# Altium schematic sheet Motor Control.SchDoc
size B; SheetNumber: 2; SheetTotal: 5
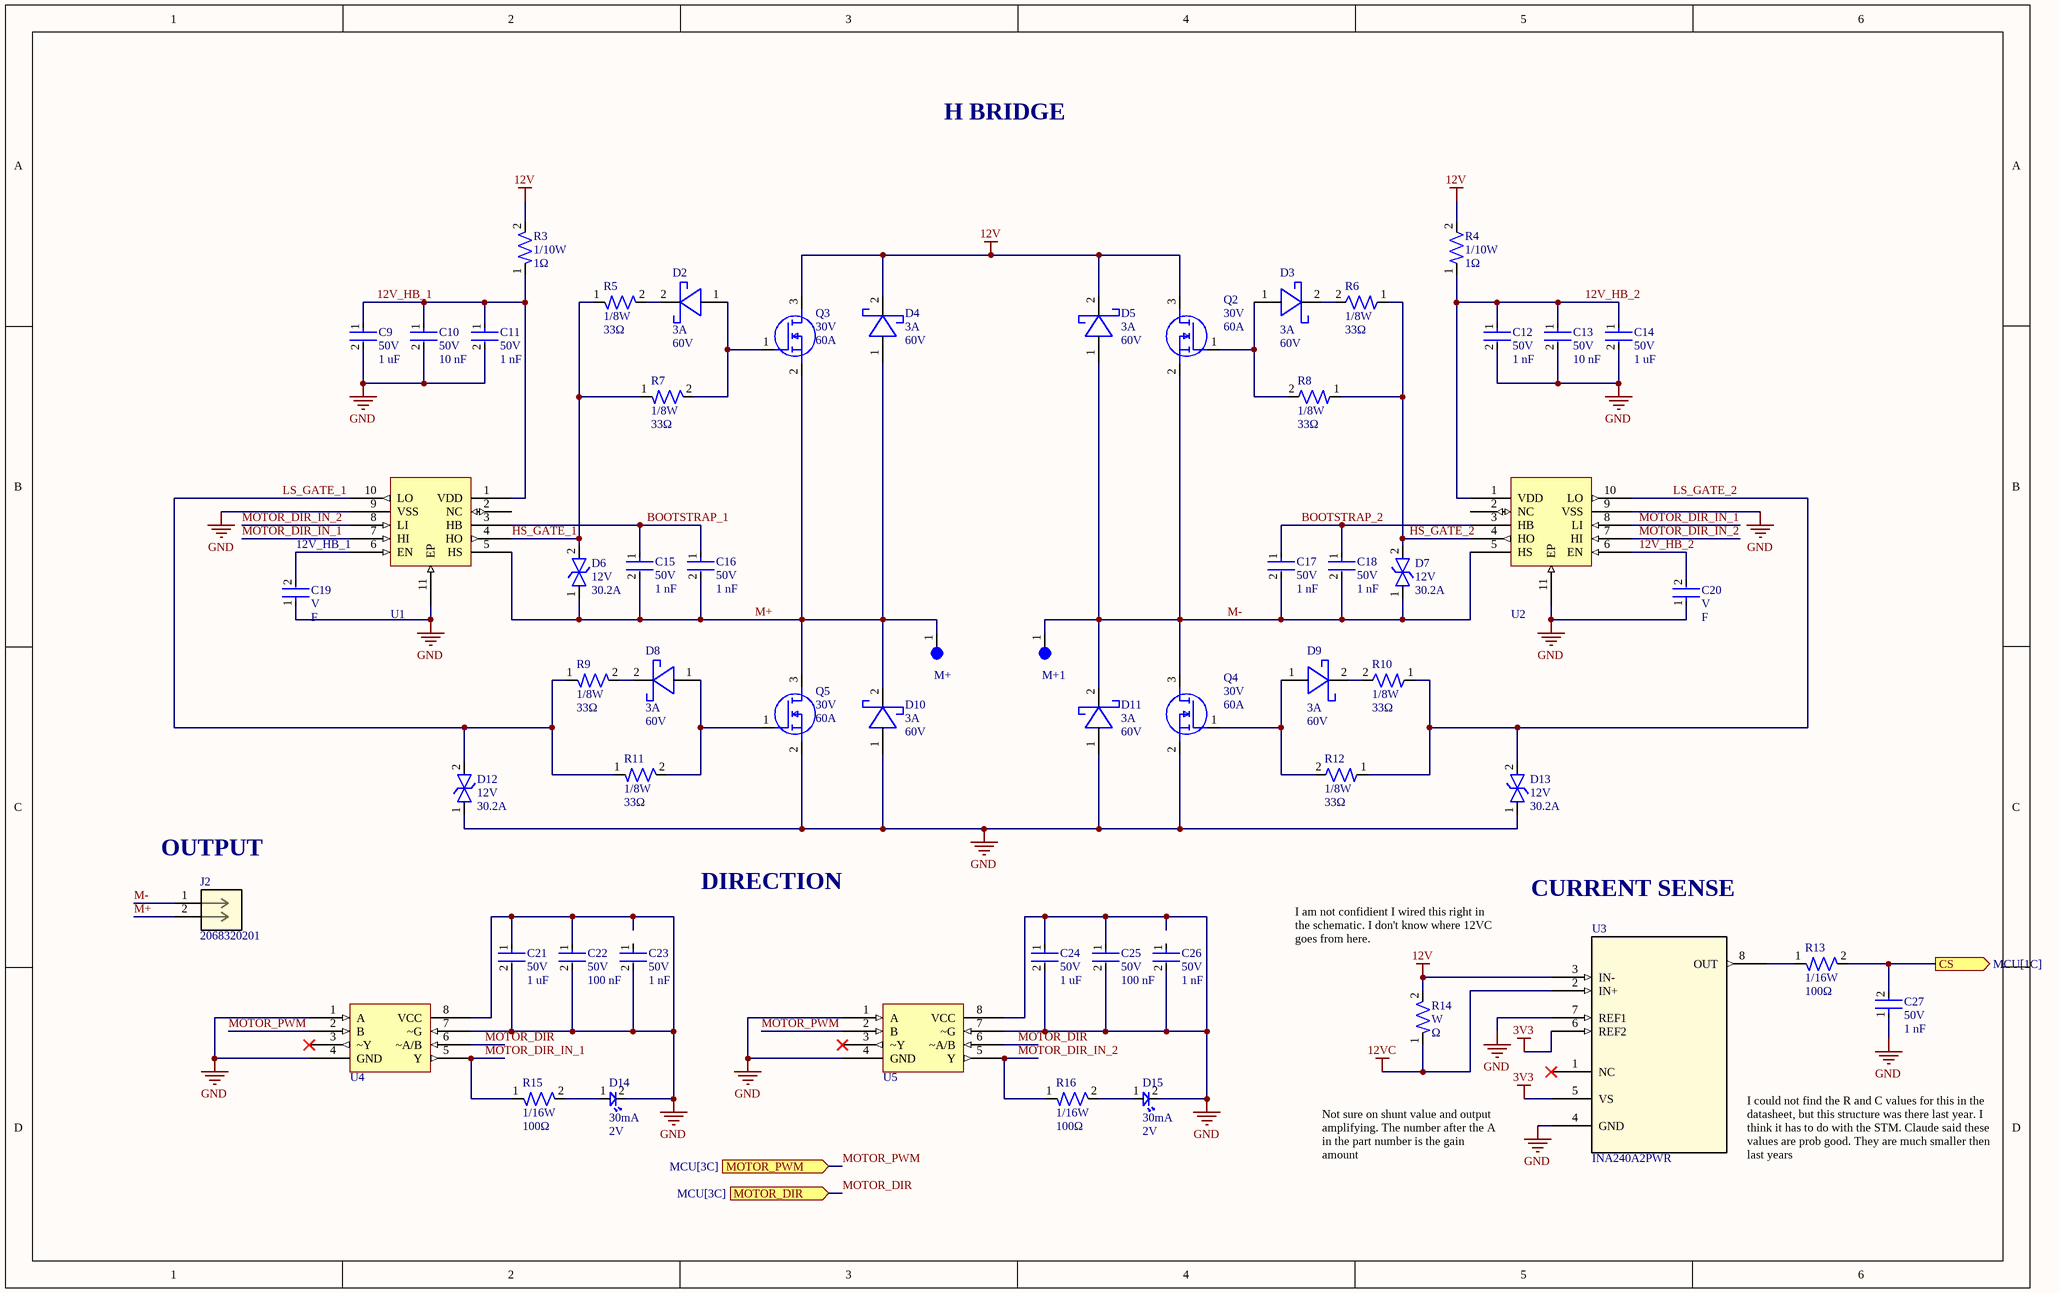
[diagram p0: Motor Control.SchDoc]

## Parts
C9  Voltage Rating: 50V  Capacitance: 1 uF  [CAP-0805]  (hidden comment: CAP 0805)
C10  Voltage Rating: 50V  Capacitance: 10 nF  [CAP-0805]  (hidden comment: CAP 0805)
C11  Voltage Rating: 50V  Capacitance: 1 nF  [CAP-0805]  (hidden comment: CAP 0805)
C12  Voltage Rating: 50V  Capacitance: 1 nF  [CAP-0805]  (hidden comment: CAP 0805)
C13  Voltage Rating: 50V  Capacitance: 10 nF  [CAP-0805]  (hidden comment: CAP 0805)
C14  Voltage Rating: 50V  Capacitance: 1 uF  [CAP-0805]  (hidden comment: CAP 0805)
C15  Voltage Rating: 50V  Capacitance: 1 nF  [CAP-0805]  (hidden comment: CAP 0805)
C16  Voltage Rating: 50V  Capacitance: 1 nF  [CAP-0805]  (hidden comment: CAP 0805)
C17  Voltage Rating: 50V  Capacitance: 1 nF  [CAP-0805]  (hidden comment: CAP 0805)
C18  Voltage Rating: 50V  Capacitance: 1 nF  [CAP-0805]  (hidden comment: CAP 0805)
C19  Voltage Rating: V  Capacitance: F  [CAP-0603]  (hidden comment: CAP 0603)
C20  Voltage Rating: V  Capacitance: F  [CAP-0603]  (hidden comment: CAP 0603)
C21  Voltage Rating: 50V  Capacitance: 1 uF  [CAP-0805]  (hidden comment: CAP 0805)
C22  Voltage Rating: 50V  Capacitance: 100 nF  [CAP-0805]  (hidden comment: CAP 0805)
C23  Voltage Rating: 50V  Capacitance: 1 nF  [CAP-0805]  (hidden comment: CAP 0805)
C24  Voltage Rating: 50V  Capacitance: 1 uF  [CAP-0805]  (hidden comment: CAP 0805)
C25  Voltage Rating: 50V  Capacitance: 100 nF  [CAP-0805]  (hidden comment: CAP 0805)
C26  Voltage Rating: 50V  Capacitance: 1 nF  [CAP-0805]  (hidden comment: CAP 0805)
C27  Voltage Rating: 50V  Capacitance: 1 nF  [CAP-0805]  (hidden comment: CAP 0805)
D2  Current Rating: 3A  Reverse Voltage: 60V  [DIO-SOD128]  (hidden comment: PMEG6030EP,115)
D3  Current Rating: 3A  Reverse Voltage: 60V  [DIO-SOD128]  (hidden comment: PMEG6030EP,115)
D4  Current Rating: 3A  Reverse Voltage: 60V  [DIO-SOD128]  (hidden comment: PMEG6030EP,115)
D5  Current Rating: 3A  Reverse Voltage: 60V  [DIO-SOD128]  (hidden comment: PMEG6030EP,115)
D6  Voltage Rating: 12V  Current Rating: 30.2A  [DO-214AA (SMBJ)]  (hidden comment: SMBJ40CA)
D7  Voltage Rating: 12V  Current Rating: 30.2A  [DO-214AA (SMBJ)]  (hidden comment: SMBJ40CA)
D8  Current Rating: 3A  Reverse Voltage: 60V  [DIO-SOD128]  (hidden comment: PMEG6030EP,115)
D9  Current Rating: 3A  Reverse Voltage: 60V  [DIO-SOD128]  (hidden comment: PMEG6030EP,115)
D10  Current Rating: 3A  Reverse Voltage: 60V  [DIO-SOD128]  (hidden comment: PMEG6030EP,115)
D11  Current Rating: 3A  Reverse Voltage: 60V  [DIO-SOD128]  (hidden comment: PMEG6030EP,115)
D12  Voltage Rating: 12V  Current Rating: 30.2A  [DO-214AA (SMBJ)]  (hidden comment: SMBJ40CA)
D13  Voltage Rating: 12V  Current Rating: 30.2A  [DO-214AA (SMBJ)]  (hidden comment: SMBJ40CA)
D14  Forward Current: 30mA  Forward Voltage: 2V  [LED-0603]  (hidden comment: BL-HKC36G-AV-TRB)
D15  Forward Current: 30mA  Forward Voltage: 2V  [LED-0603]  (hidden comment: BL-HKC36G-AV-TRB)
J2  2068320201  [CONN_2068320000-SD_02_MOL]
M+  5003  [TEST-POINT-0001]  (value not drawn)
M+1  5003  [TEST-POINT-0001]  (value not drawn)
Q2  Voltage: 30V  Continuous Current: 60A  [IC-8VSONCLIP]  (hidden comment: CSD17575Q3)
Q3  Voltage: 30V  Continuous Current: 60A  [IC-8VSONCLIP]  (hidden comment: CSD17575Q3)
Q4  Voltage: 30V  Continuous Current: 60A  [IC-8VSONCLIP]  (hidden comment: CSD17575Q3)
Q5  Voltage: 30V  Continuous Current: 60A  [IC-8VSONCLIP]  (hidden comment: CSD17575Q3)
R3  Wattage: 1/10W  Resistance: 1Ω  [RES-0805]  (hidden comment: RES 0805)
R4  Wattage: 1/10W  Resistance: 1Ω  [RES-0805]  (hidden comment: RES 0805)
R5  Wattage: 1/8W  Resistance: 33Ω  [RES-0805]  (hidden comment: RES 0805)
R6  Wattage: 1/8W  Resistance: 33Ω  [RES-0805]  (hidden comment: RES 0805)
R7  Wattage: 1/8W  Resistance: 33Ω  [RES-0805]  (hidden comment: RES 0805)
R8  Wattage: 1/8W  Resistance: 33Ω  [RES-0805]  (hidden comment: RES 0805)
R9  Wattage: 1/8W  Resistance: 33Ω  [RES-0805]  (hidden comment: RES 0805)
R10  Wattage: 1/8W  Resistance: 33Ω  [RES-0805]  (hidden comment: RES 0805)
R11  Wattage: 1/8W  Resistance: 33Ω  [RES-0805]  (hidden comment: RES 0805)
R12  Wattage: 1/8W  Resistance: 33Ω  [RES-0805]  (hidden comment: RES 0805)
R13  Wattage: 1/16W  Resistance: 100Ω  [RES-0805]  (hidden comment: RES 0805)
R14  Wattage: W  Resistance: Ω  [RES-2512]  (hidden comment: RES 2512)
R15  Wattage: 1/16W  Resistance: 100Ω  [RES-0805]  (hidden comment: RES 0805)
R16  Wattage: 1/16W  Resistance: 100Ω  [RES-0805]  (hidden comment: RES 0805)
U1  UCC27282DRCR  [IC-10VSON]  (value not drawn)
U2  UCC27282DRCR  [IC-10VSON]  (value not drawn)
U3  INA240A2PWR  [PW0008A_N_TEX]
U4  SN74LVC2G157DCUR  [IC-8VSSOP]  (value not drawn)
U5  SN74LVC2G157DCUR  [IC-8VSSOP]  (value not drawn)

## Ports
CS (out, see MCU[1C]), MOTOR_DIR (in, see MCU[3C]), MOTOR_PWM (in, see MCU[3C])

## Nets
3V3: U3.5(VS) U3.6(REF2)
12V: D4.2(ANODE) D5.2(ANODE) Q2.3(D) Q3.3(D) R3.2 R4.2 R14.2 U3.3(IN-)
12VC: R14.1 U3.2(IN+)
GND: C9.2 C10.2 C11.2 C12.2 C13.2 C14.2 C19.1 C20.1 C21.1 C21.2 C22.1 C22.2 C23.2 C24.1 C24.2 C25.1 C25.2 C26.2 C27.1 D10.1(CATHODE) D11.1(CATHODE) D12.1 D13.1 D14.2 D15.2 Q4.2(S) Q5.2(S) U1.9(VSS) U1.11(EP) U2.9(VSS) U2.11(EP) U3.4(GND) U3.7(REF1) U4.1(A) U4.4(GND) U4.7(~G) U4.8(VCC) U5.1(A) U5.4(GND) U5.7(~G) U5.8(VCC)
12V_HB_1: C9.1 C10.1 C11.1 R3.1 U1.1(VDD)
12V_HB_2: C12.1 C13.1 C14.1 C20.2 R4.1 U2.1(VDD) U2.6(EN)
BOOTSTRAP_1: C15.1 C16.1 U1.3(HB)
BOOTSTRAP_2: C17.1 C18.1 U2.3(HB)
CS: C27.2 R13.2 ; port CS
HS_GATE_1: D6.2 R5.1 R7.1 U1.4(HO)
HS_GATE_2: D7.2 R6.1 R8.1 U2.4(HO)
LS_GATE_1: D12.2 R9.1 R11.1 U1.10(LO)
LS_GATE_2: D13.2 R10.1 R12.1 U2.10(LO)
M+: C15.2 C16.2 D4.1(CATHODE) D6.1 D10.2(ANODE) J2.2 M+.1 Q3.2(S) Q5.3(D) U1.5(HS)
M-: C17.2 C18.2 D5.1(CATHODE) D7.1 D11.2(ANODE) J2.1 M+1.1 Q2.2(S) Q4.3(D) U2.5(HS)
MOTOR_DIR: U4.6(~A/B) U5.6(~A/B) ; port MOTOR_DIR
MOTOR_DIR_IN_1: R15.1 U1.7(HI) U2.8(LI) U4.5(Y)
MOTOR_DIR_IN_2: R16.1 U1.8(LI) U2.7(HI) U5.5(Y)
MOTOR_PWM: U4.2(B) U5.2(B) ; port MOTOR_PWM
NetC19_2: C19.2 U1.6(EN)
NetD2_1: D2.1(CATHODE) Q3.1(G) R7.2
NetD2_2: D2.2(ANODE) R5.2
NetD3_1: D3.1(CATHODE) Q2.1(G) R8.2
NetD3_2: D3.2(ANODE) R6.2
NetD8_1: D8.1(CATHODE) Q5.1(G) R11.2
NetD8_2: D8.2(ANODE) R9.2
NetD9_1: D9.1(CATHODE) Q4.1(G) R12.2
NetD9_2: D9.2(ANODE) R10.2
NetD14_1: D14.1 R15.2
NetD15_1: D15.1 R16.2
NetR13_1: R13.1 U3.8(OUT)

Not connected (* = marked no-connect by the designer): C23 1; C26 1; U1 2(NC); U2 2(NC); U3 1(NC)*; U4 3(~Y)*; U5 3(~Y)*

## Notes on the sheet
- H BRIDGE
- 12V_HB_1
- (near J2) OUTPUT
- DIRECTION
- CURRENT SENSE
- (near R14) I am not confidient I wired this right in the schematic. I don't know where 12VC goes from here.
- Not sure on shunt value and output amplifying. The number after the A in the part number is the gain amount
- (near U3) I could not find the R and C values for this in the datasheet, but this structure was there last year. I think it has to do with the STM. Claude said these values are prob good. They are much smaller then last years

## Library data of the parts
D2-D5 D8-D11 = DIO-SCHOTTKY-0003: DIODE SCHOTTKY 60V 3A SOD128; ComponentLink1Description: Datasheet; ComponentLink1URL: https://assets.nexperia.com/documents/data-sheet/PMEG6030EP.pdf
D6 D7 D12 D13 = DIO-TVS-0001: TVS DIODE 40VWM 64.5VC DO214AA; ComponentLink1Description: Datasheet; ComponentLink1URL: https://www.littelfuse.com/media?resourcetype=datasheets&itemid=09a6ae9a-73cb-4ac4-acac-e6dab92ab953&filename=littelfuse_tvs_diode_smbj_datasheet.pdf
D14 D15 = LED-0001: LED YELLOW CLEAR 0603 SMD; ComponentLink1Description: Datasheet; ComponentLink1URL: https://www.americanbrightled.com/pdffiles/led-components/smt/BL-HKC36G-AV-TRB.pdf
J2 = CONN MF+ 2 PIN VERT: Micro-Fit+ Vertical Header, Through Hole, 3.00mm Pitch, Dual Row, 2 Circuits, Tin (Sn) Plating, Glow-Wire Capable, Black, Tray; Manufacturer_Name: Molex Connector Corporation; Copyright: Copyright (C) 2025 Ultra Librarian. All rights reserved.; Manufacturer_Part_Number: 2068320201; RefDes: RefDes; Type: Type
M+ M+1 = TEST-POINT-0001: Oranange PC Test Point, Miniature Phoisphor Bronze Silver Plating Through Hole Mounting Type
Q2-Q5 = NMOS-26A-0001: MOSFET N-CH 30V 60A 8VSON; ComponentLink1Description: Datasheet; ComponentLink1URL: https://www.ti.com/lit/ds/symlink/csd17575q3.pdf?ts=1728565072242&ref_url=https%253A%252F%252Fwww.mouser.co.uk%252F
U1 U2 = IC-GTDR-0001: IC GATE DRVR HALF-BRIDGE 10VSON; VCC Max: 16; Package: 10-VSON; ComponentLink1Description: Datasheet; ComponentLink1URL: https://www.ti.com/lit/ds/symlink/ucc27282.pdf?HQS=dis-dk-null-digikeymode-dsf-pf-null-wwe&ts=1728563165008&ref_url=https%253A%252F%252Fwww.ti.com
U3 = INA240A2PWR: -4 to 80V, bidirectional, ultra-precise current sense amplifier with enhanced PWM rejection 8-TSSOP -40 to 125; Manufacturer_Name: Texas Instruments; Copyright: Copyright (C) 2026 Ultra Librarian. All rights reserved.; Manufacturer_Part_Number: INA240A2PWR; RefDes: RefDes; Type: Type
U4 U5 = IC-MUX-0001: Multiplexer 1 x 2:1 8-VSSOP; ComponentLink1Description: Datasheet; ComponentLink1URL: https://www.ti.com/general/docs/suppproductinfo.tsp?distId=10&gotoUrl=https%3A%2F%2Fwww.ti.com%2Flit%2Fgpn%2Fsn74lvc2g157